# EAGLE design vfd_drive (EAGLE 9.5.2)
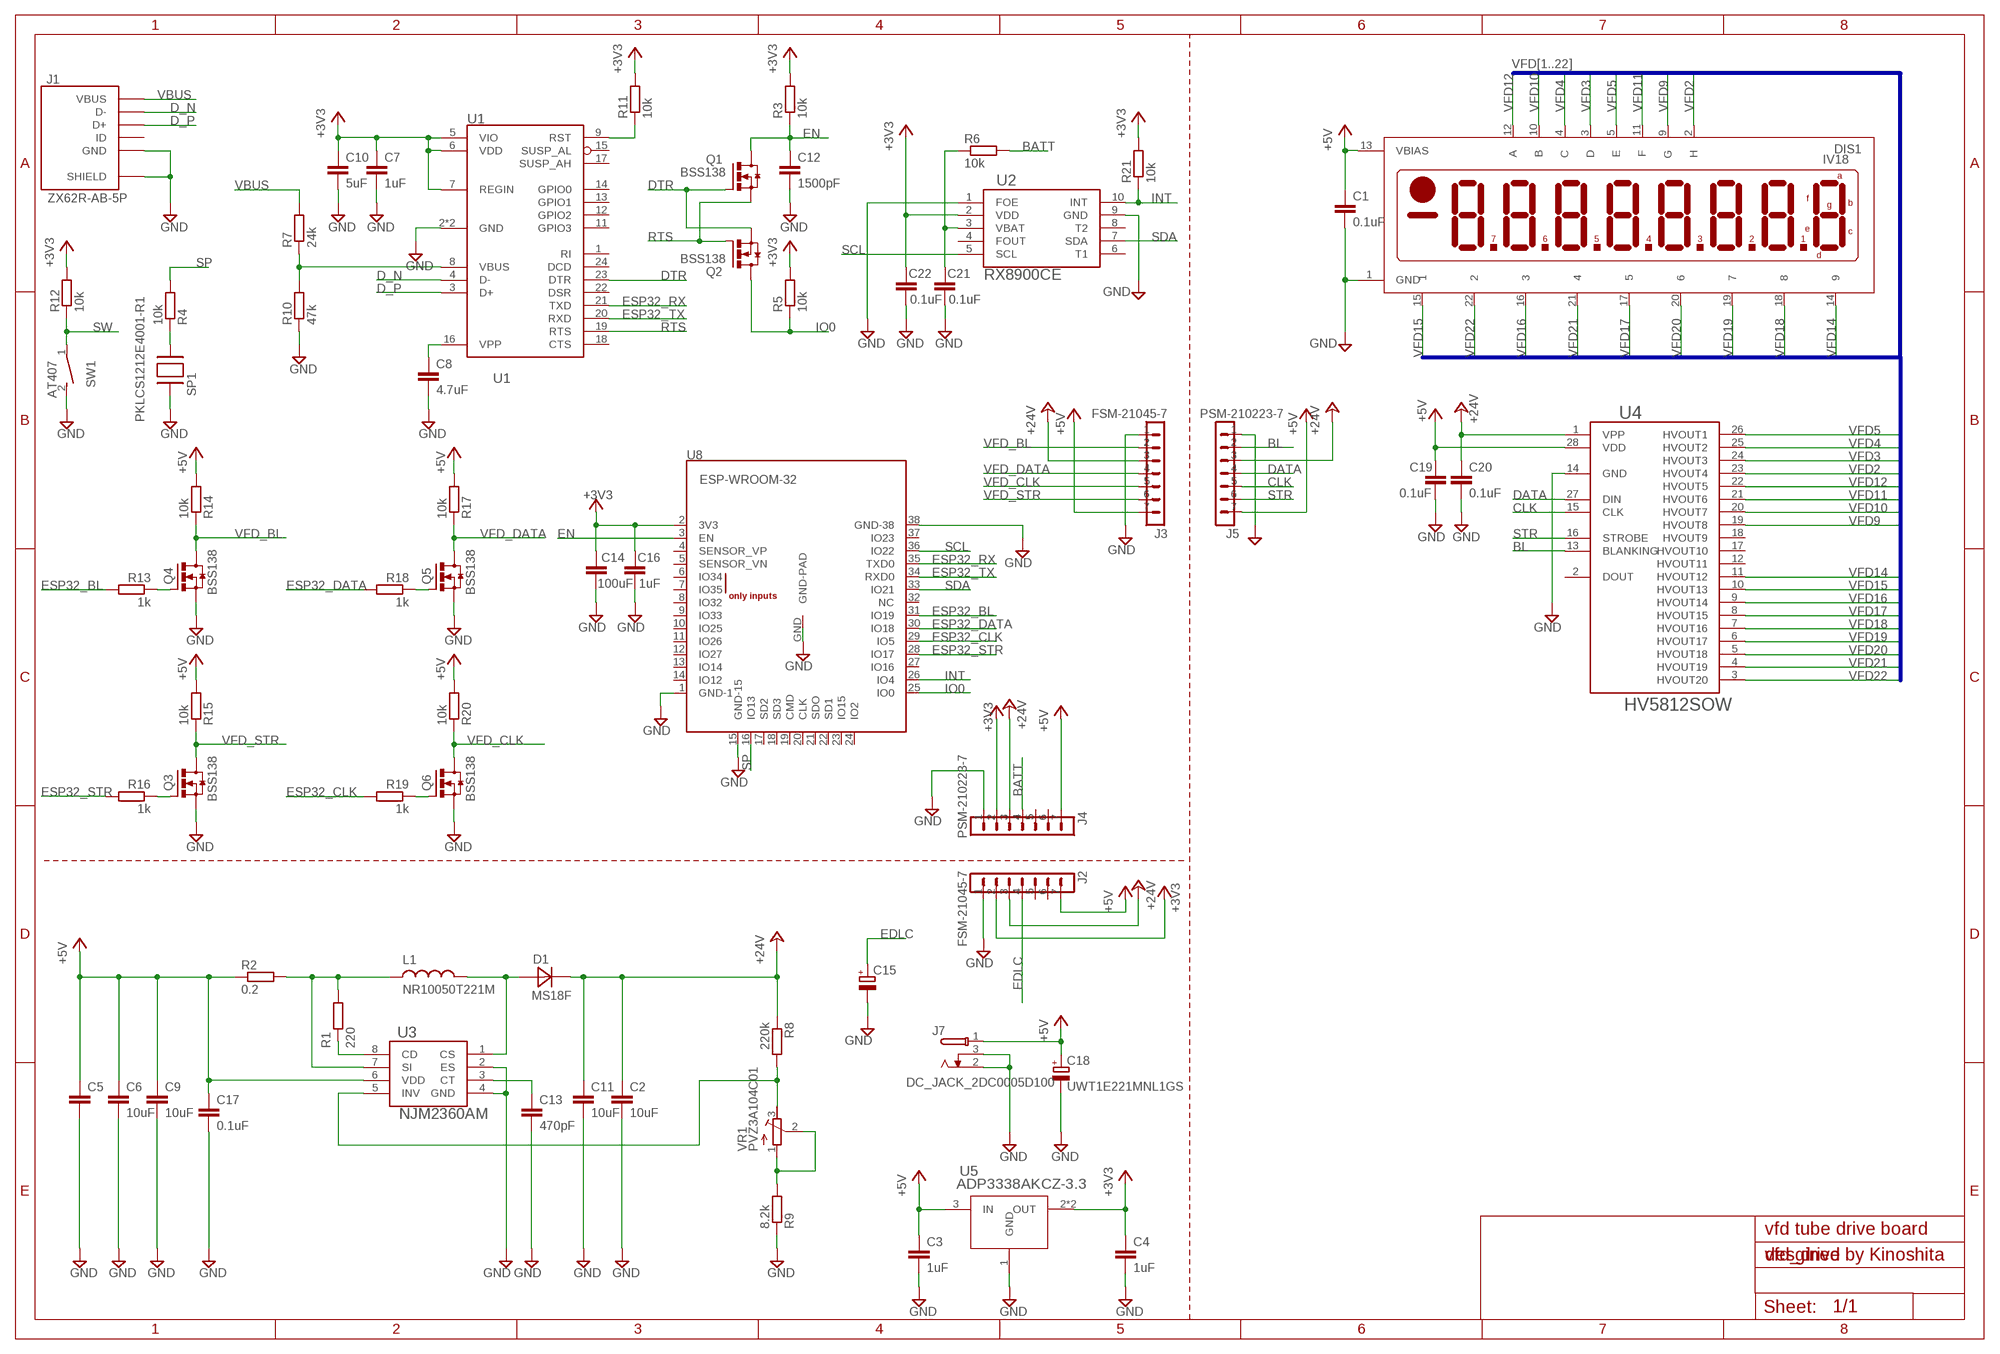
[diagram p0: schematic, sheet 1]

## Parts
C1  0.1uF  C-EUC0603  [C0603]
C2  10uF  C-EUC3216  [C3216]
C3  1uF  C-EUC0603  [C0603]
C4  1uF  C-EUC0603  [C0603]
C5  C-EUC3225  [C3225]
C6  10uF  C-EUC0603  [C0603]
C7  1uF  C-EUC0603  [C0603]
C8  4.7uF  C-EUC0603  [C0603]
C9  10uF  C-EUC0603  [C0603]
C10  5uF  C-EUC0603  [C0603]
C11  10uF  C-EUC3216  [C3216]
C12  1500pF  C-EUC0603  [C0603]
C13  470pF  C-EUC0603  [C0603]
C14  100uF  C-EUC1206  [C1206]
C15  CPOL-EUSE-5R5-D155VY  [SE-5R5-D155VY]
C16  1uF  C-EUC0603  [C0603]
C17  0.1uF  C-EUC0603  [C0603]
C18  UWT1E221MNL1GS  [NICHICON-ALMINUM-CAPACITOR-8MM]
C19  0.1uF  C-EUC0603  [C0603]
C20  0.1uF  C-EUC0603  [C0603]
C21  0.1uF  C-EUC0603  [C0603]
C22  0.1uF  C-EUC0603  [C0603]
D1  MS18F  [SMAF]
DIS1  IV18  [IV18]
J1  ZX62R-AB-5P  [ZX62R-B-5PA]
J2  FSM-21045-7  [FSM-21045-7]
J3  FSM-21045-7  [FSM-21045-7]
J4  PSM-210223-7  [PSM-210223-7]
J5  PSM-210223-7  [PSM-210223-7]
J7  DC_JACK_2DC0005D100  [DC_JACK_2DC0005D100]
L1  NR10050T221M  [NR10050T100M]
Q1  BSS138  [SOT23-N-MOSFET]
Q2  BSS138  [SOT23-N-MOSFET]
Q3  BSS138  [SOT23-N-MOSFET]
Q4  BSS138  [SOT23-N-MOSFET]
Q5  BSS138  [SOT23-N-MOSFET]
Q6  BSS138  [SOT23-N-MOSFET]
R1  220  R-EU_R0603  [R0603]
R2  0.2  R-EU_R1206  [R1206]
R3  10k  R-EU_R0603  [R0603]
R4  10k  R-EU_R0603  [R0603]
R5  10k  R-EU_R0603  [R0603]
R6  10k  R-EU_R0603  [R0603]
R7  24k  R-EU_R0603  [R0603]
R8  220k  R-EU_R0603  [R0603]
R9  8.2k  R-EU_R0603  [R0603]
R10  47k  R-EU_R0603  [R0603]
R11  10k  R-EU_R0603  [R0603]
R12  10k  R-EU_R0603  [R0603]
R13  1k  R-EU_R0603  [R0603]
R14  10k  R-EU_R0603  [R0603]
R15  10k  R-EU_R0603  [R0603]
R16  1k  R-EU_R0603  [R0603]
R17  10k  R-EU_R0603  [R0603]
R18  1k  R-EU_R0603  [R0603]
R19  1k  R-EU_R0603  [R0603]
R20  10k  R-EU_R0603  [R0603]
R21  10k  R-EU_R0603  [R0603]
SP1  PKLCS1212E4001-R1  [PKLCS1212E4001-R1]
SW1  AT407  [AT407]
U1  CP2104  [QFN24-SILABS]
U2  RX8900CE  [RX8900CE]
U3  NJM2360AM  [DMP8]
U4  HV5812SOW  [SOW28-MICROCHIP]
U5  ADP3338AKCZ-3.3  [SOT233]
U8  ESP-WROOM-32  [ESP-WROOM-32]
VR1  PVZ3A104C01  [PVZ3A]

## Nets
+3V3 [POWER]: C4.1 C7.1 C10.1 C14.1 C16.1 C22.1 J2.2 J4.2 R3.2 R5.2 R11.2 R12.2 R21.2 U1.5(VIO) U1.6(VDD) U1.7(REGIN) U2.2(VDD) U5.2(OUT) U5.4(OUT) U8.2(3V3)
+5V: C1.1 C3.1 C5.1 C6.1 C9.1 C17.1 C18.POS(+) C19.1 DIS1.13(VBIAS) J2.7 J3.7 J4.7 J5.7 J7.1 R2.1 R14.2 R15.2 R17.2 R20.2 U3.6(VDD) U4.28(VDD) U5.3(IN)
+24V: C2.1 C11.1 C20.1 D1.K(C) J2.3 J3.3 J4.3 J5.3 R8.1 U4.1(VPP)
BATT: J4.4 R6.2
BL: J5.2 U4.13(BLANKING)
CLK: J5.5 U4.15(CLK)
D_N: J1.D- U1.4(D-)
D_P: J1.D+ U1.3(D+)
DATA: J5.4 U4.27(DIN)
DTR: Q1.G Q2.S U1.23(DTR)
EDLC: C15.POS(+) J2.4
EN: C12.1 Q1.D R3.1 U8.3(EN)
ESP32_BL: R13.2 U8.31(IO19)
ESP32_CLK: R19.2 U8.29(IO5)
ESP32_DATA: R18.2 U8.30(IO18)
ESP32_RX: U1.21(TXD) U8.35(TXD0)
ESP32_STR: R16.2 U8.28(IO17)
ESP32_TX: U1.20(RXD) U8.34(RXD0)
GND: C1.2 C2.2 C3.2 C4.2 C5.2 C6.2 C7.2 C8.2 C9.2 C10.2 C11.2 C12.2 C13.2 C14.2 C15.NEG(-) C16.2 C17.2 C18.NEG(-) C19.2 C20.2 C21.2 C22.2 DIS1.1(GND) J1.GND J1.SHIELD@1(SHIELD) J1.SHIELD@2(SHIELD) J1.SHIELD@3(SHIELD) J1.SHIELD@4(SHIELD) J2.1 J3.1 J4.1 J5.1 J7.2 J7.3 Q3.S Q4.S Q5.S Q6.S R9.1 R10.1 SP1.2 SW1.2 U1.2(GND) U1.25(GND) U2.1(FOE) U2.9(GND) U3.2(ES) U3.4(GND) U4.14(GND) U5.1(GND) U8.1(GND-1) U8.15(GND-15) U8.38(GND-38) U8.GND(GND-PAD)
INT: R21.1 U2.10(INT) U8.26(IO4)
IO0: Q2.D R5.1 U8.25(IO0)
N$1: R9.2 VR1.1(E) VR1.2(S)
N$2: Q4.G R13.1
N$3: Q6.G R19.1
N$4: Q3.G R16.1
N$5: C21.1 R6.1 U2.3(VBAT)
N$6: D1.A L1.P$2 U3.1(CS)
N$7: R11.1 U1.9(RST)
N$8: R7.1 R10.2 U1.8(VBUS)
N$9: C8.1 U1.16(VPP)
N$10: R4.1 SP1.1
N$11: C13.1 U3.3(CT)
N$12: R8.2 U3.5(INV) VR1.3(A)
N$13: R1.1 U3.8(CD)
N$14: L1.P$1 R1.2 R2.2 U3.7(SI)
N$15: Q5.G R18.1
RTS: Q1.S Q2.G U1.19(RTS)
SCL: U2.5(SCL) U8.36(IO22)
SDA: U2.7(SDA) U8.33(IO21)
SP: R4.2 U8.16(IO13)
STR: J5.6 U4.16(STROBE)
SW: R12.1 SW1.1
VBUS: J1.VCC(VBUS) R7.2
VFD2: DIS1.2(H) U4.23(HVOUT4)
VFD3: DIS1.3(D) U4.24(HVOUT3)
VFD4: DIS1.4(C) U4.25(HVOUT2)
VFD5: DIS1.5(E) U4.26(HVOUT1)
VFD9: DIS1.9(G) U4.19(HVOUT8)
VFD10: DIS1.10(B) U4.20(HVOUT7)
VFD11: DIS1.11(F) U4.21(HVOUT6)
VFD12: DIS1.12(A) U4.22(HVOUT5)
VFD14: DIS1.14 U4.11(HVOUT12)
VFD15: DIS1.15 U4.10(HVOUT13)
VFD16: DIS1.16 U4.9(HVOUT14)
VFD17: DIS1.17 U4.8(HVOUT15)
VFD18: DIS1.18 U4.7(HVOUT16)
VFD19: DIS1.19 U4.6(HVOUT17)
VFD20: DIS1.20 U4.5(HVOUT18)
VFD21: DIS1.21 U4.4(HVOUT19)
VFD22: DIS1.22 U4.3(HVOUT20)
VFD_BL: J3.2 Q4.D R14.1
VFD_CLK: J3.5 Q6.D R20.1
VFD_DATA: J3.4 Q5.D R17.1
VFD_STR: J3.6 Q3.D R15.1
Unconnected: J1.ID J2.5 J2.6 J4.5 J4.6 U1.1(RI) U1.11(GPIO3) U1.12(GPIO2) U1.13(GPIO1) U1.14(GPIO0) U1.15(SUSP_AL) U1.17(SUSP_AH) U1.18(CTS) U1.22(DSR) U1.24(DCD) U2.4(FOUT) U2.6(T1) U2.8(T2) U4.2(DOUT) U4.12(HVOUT11) U4.17(HVOUT10) U4.18(HVOUT9) U8.4(SENSOR_VP) U8.5(SENSOR_VN) U8.6(IO34) U8.7(IO35) U8.8(IO32) U8.9(IO33) U8.10(IO25) U8.11(IO26) U8.12(IO27) U8.13(IO14) U8.14(IO12) U8.17(SD2) U8.18(SD3) U8.19(CMD) U8.20(CLK) U8.21(SDO) U8.22(SD1) U8.23(IO15) U8.24(IO2) U8.27(IO16) U8.32(NC) U8.37(IO23)

## Buses
VFD[1..22]

## Notes on the sheet
- vfd tube drive board
- desgined by Kinoshita

## Library data of the parts
C1-C14 C16 C17 C19-C22 = taki-library:C-EU: CAPACITOR, European symbol
C15 = taki-library:CPOL-EU: POLARIZED CAPACITOR, European symbol
C18 = taki-library:UWT1E221MNL1GS
D1 = taki-library:MS18F
DIS1 = taki-library:IV18: LCD DISPLAY 8-character 7 segment
J1 = taki-library:ZX62
J2 J3 = taki-library:FSM-21045-7
J4 J5 = taki-library:PSM-210223-7
J7 = taki-library:DC_JACK_2DC0005D100: AKIZUKIDENSHI 2DC-0005D100 SINGATRON ENTERPRISE CO., LTD http://akizukidenshi.com/download/2DC-0005D100.pdf
L1 = taki-library:NR10050T221M
Q1-Q6 = taki-library:BSS138
R1-R21 = taki-library:R-EU_: RESISTOR, European symbol
SP1 = taki-library:PKLCS1212E4001-R1
SW1 = taki-library:AT407
U1 = taki-library:CP2104
U2 = taki-library:RX8900CE
U3 = taki-library:NJM2360AM; STORE: RS; URL: https://jp.rs-online.com/web/p/dc-dc-controllers/7139849/
U4 = taki-library:HV5812
U5 = taki-library:ADP3338AKCZ-3.3
U8 = taki-library:ESP-WROOM-32
VR1 = taki-library:PVZ3A104C01

## Net classes
0 default: width 0.152 mm
1 POWER: width 0.254 mm
2 diffrencial pair: width 0.15 mm, clearance 0.3 mm to class 0, clearance 0.3 mm to class 1, clearance 0.15 mm
3 3pin digital: width 0.15 mm
4 high-voltage: width 0.3 mm, clearance 0.7 mm to class 0, clearance 0.7 mm to class 1, clearance 0.7 mm to class 2, clearance 0.7 mm to class 3, clearance 0.7 mm

## Board
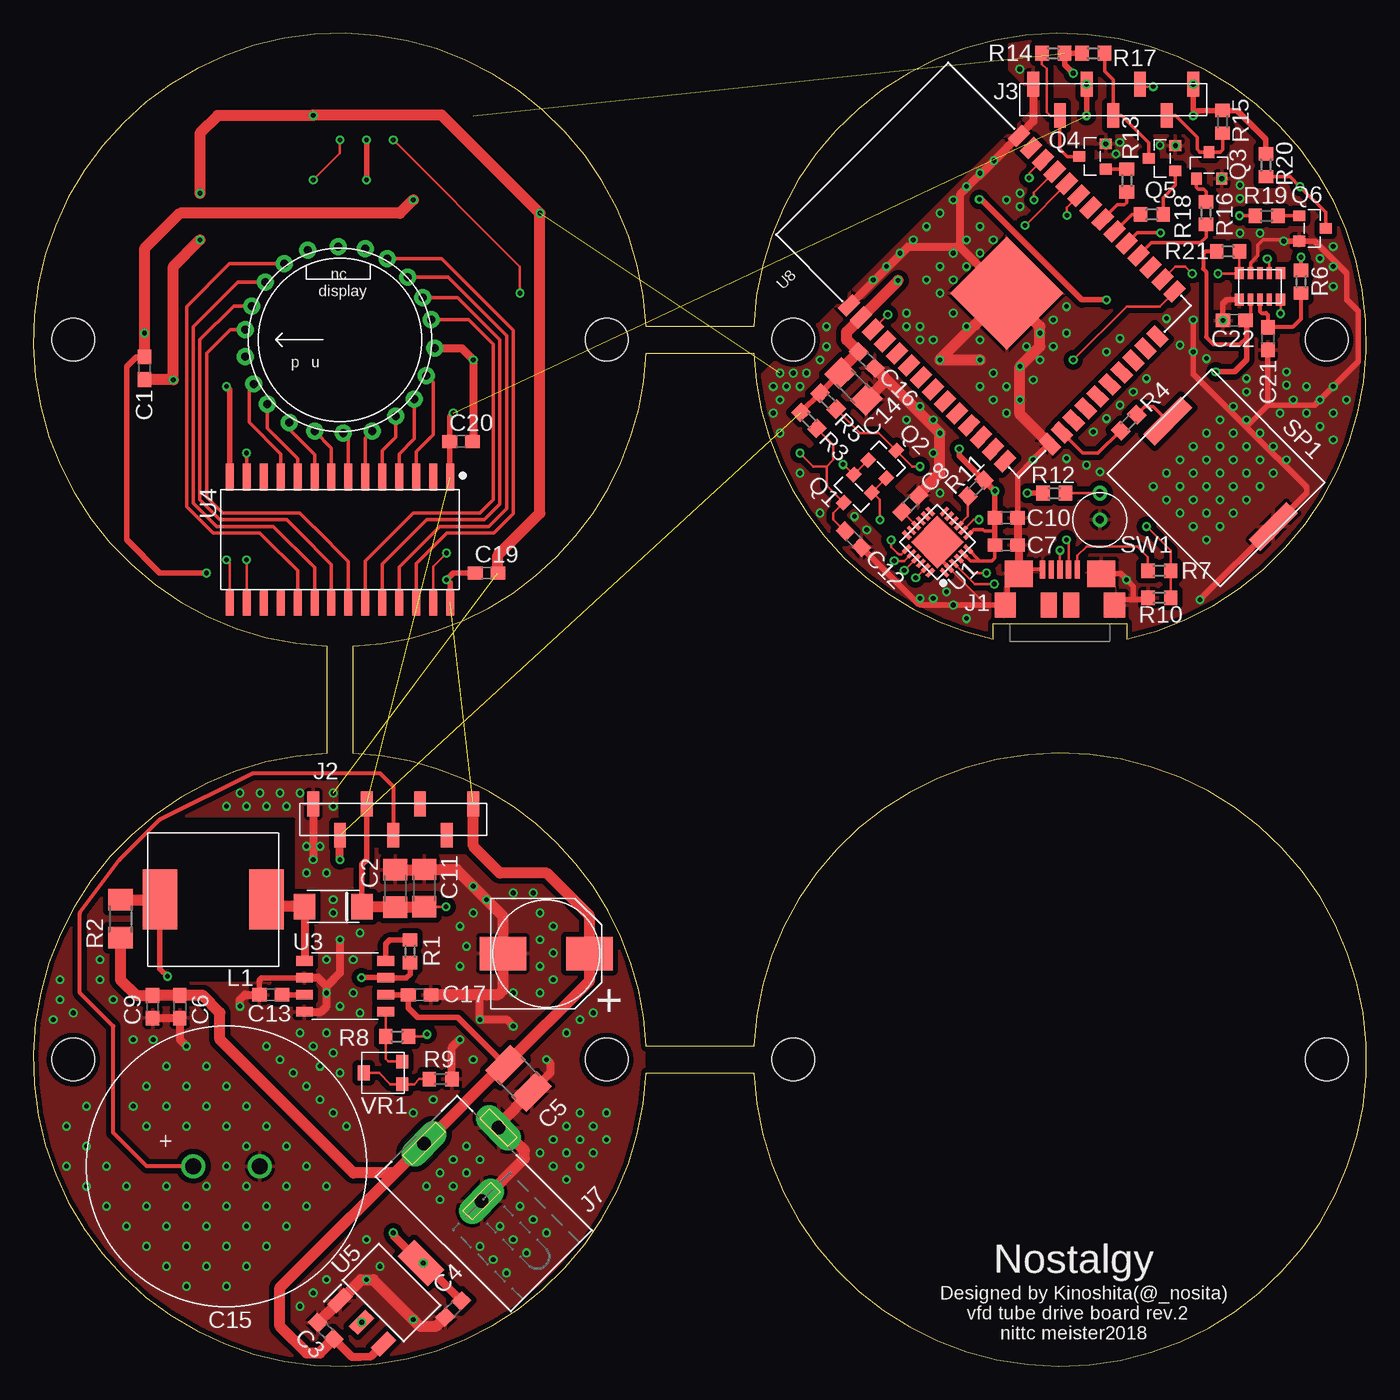
[diagram p1: board, top side]
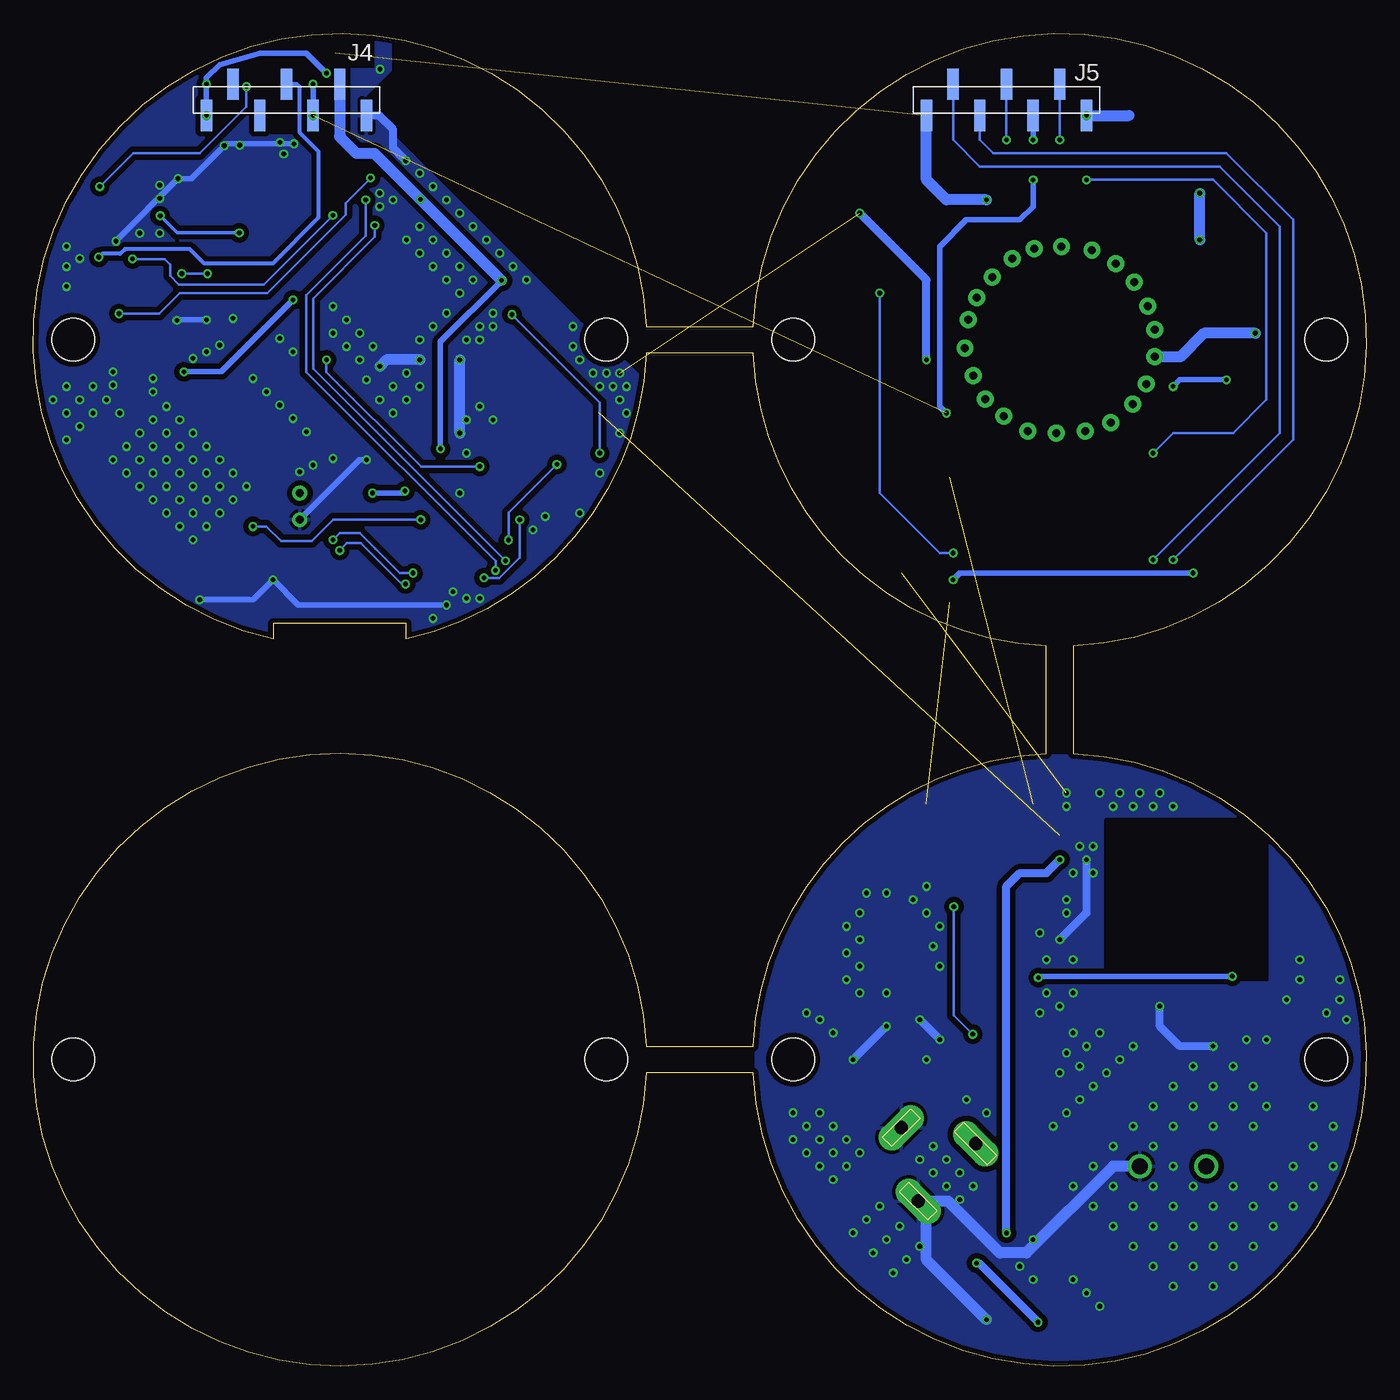
[diagram p2: board, bottom side, seen from below]

Size 99.98 x 100 mm. Coordinates in mm from the lower left corner, seen from the top.
Outline: 82,54.55 arc255 54.02,78 45.97,78 arc265 22,54.02 22,45.98 arc265 45.97,22 54.02,22 arc355 54.02,24 45.97,24 arc85 24,45.98 24,54.02 arc85 45.97,76 54.02,76 arc75 72,54.55 72,55.7 82,55.7 82,54.55
Copper layers (1*16): Top 0.035mm / dielectric 1.5mm / Bottom 0.035mm
Design rules "Elecrow_2-layer_eagle_rule": minimum track width 6mil, minimum drill 12mil, track to track 6mil, track to pad 6mil, pad to pad 6mil, via to via 6mil, smd to smd 0mil, copper to edge 10mil, drill to drill 10mil, minimum pad ring 10mil, minimum via ring 6mil, stop-mask expansion 2mil, vias tented up to drill 100mil, thermal gap 10mil
Holes 3.2 mm at 3,77 43,77 57,77 97,77 57,23 3,23 43,23 97,23

### Footprints (pad centres in the part's own frame; a part is rotated, then mirrored left to right if it is on the bottom)
C0603 = smd 1.1 x 1: 1 -0.85,0; 2 0.85,0
C3216 = smd 1.6 x 1.8: 1 -1.4,0; 2 1.4,0
C3225 = smd 1.6 x 2.7: 1 -1.4,0; 2 1.4,0
C1206 = smd 1.6 x 1.8: 1 -1.4,0; 2 1.4,0
SE-5R5-D155VY = drill 1.2: NEG 2.5,0; POS -2.5,0
NICHICON-ALMINUM-CAPACITOR-8MM = smd 2.5 x 3.5: NEG 0,-3.25; POS 0,3.25
SMAF = smd 1.6 x 1.9: A -2.15,0; K 2.15,0
IV18 = drill 0.6 pad 1.27: 1 -0.635,-7.112; 2 1.524,-6.858; 3 3.175,-6.223; 4 4.699,-5.08; 5 6.096,-3.556; 6 6.858,-1.905; 7 6.985,0.127; 8 6.731,2.413; 9 5.715,4.191; 10 4.318,5.588; 11 2.54,6.604; 12 0.762,7.112; 13 -1.27,7.112; 14 -3.302,6.477; 15 -4.826,5.461; 16 -6.223,3.81; 17 -6.858,1.905; 18 -6.985,-0.254; 19 -6.858,-2.413; 20 -5.715,-4.191; 21 -4.445,-5.588; 22 -2.667,-6.477
ZX62R-B-5PA = smd 0.4 x 1.35: D+ 0,2.675; D- 0.65,2.675; GND -1.3,2.675; ID -0.65,2.675; VCC 1.3,2.675 | smd 1.2 x 1.9: NC@1 -0.85,0; NC@2 0.85,0 | smd 2.1 x 2: SHIELD@1 -3.1,2.35; SHIELD@2 3.1,2.35 | smd 1.6 x 1.9: SHIELD@3 -4.1,0; SHIELD@4 4.1,0
FSM-21045-7 = smd 0.89 x 1.85: 1 0,1.175; 2 2,-1.175; 3 4,1.175; 4 6,-1.175; 5 8,1.175; 6 10,-1.175; 7 12,1.175
PSM-210223-7 = smd 0.85 x 2.35: 1 0,1.175; 2 2,-1.175; 3 4,1.175; 4 6,-1.175; 5 8,1.175; 6 10,-1.175; 7 12,1.175
DC_JACK_2DC0005D100 = drill 1 pad 2 long: 1 -3.1,0; 2 3,0; 3 0,4.8
NR10050T100M = smd 2.6 x 4.5: P$1 -4,0; P$2 4,0
SOT23-N-MOSFET = smd 0.8 x 0.9: D 0,1; G -0.95,-1; S 0.95,-1
R0603 = smd 1 x 1.1: 1 -0.85,0; 2 0.85,0
R1206 = smd 1.6 x 1.803: 1 -1.422,0; 2 1.422,0
PKLCS1212E4001-R1 = smd 1.2 x 4: 1 11.2,0; 2 0,0
AT407 = drill 0.6: 1 0,2; 2 0,0
QFN24-SILABS = smd 0.75 x 0.3: 1 -2,1.25; 2 -2,0.75; 3 -2,0.25; 4 -2,-0.25; 5 -2,-0.75; 6 -2,-1.25; 13 2,-1.25; 14 2,-0.75; 15 2,-0.25; 16 2,0.25; 17 2,0.75; 18 2,1.25 | smd 0.3 x 0.75: 7 -1.25,-2; 8 -0.75,-2; 9 -0.25,-2; 10 0.25,-2; 11 0.75,-2; 12 1.25,-2; 19 1.25,2; 20 0.75,2; 21 0.25,2; 22 -0.25,2; 23 -0.75,2; 24 -1.25,2 | smd 2.8 x 2.8: 25 0,0
RX8900CE = smd 0.7 x 0.9: 1 -1.55,-1; 5 1.55,-1; 8 1.55,1; 10 -1.55,1 | smd 0.4 x 0.9: 2 -0.7,-1; 3 0,-1; 4 0.7,-1; 6 0,1; 7 0.7,1; 9 -0.7,1
DMP8 = smd 1.27 x 0.72: 1 -3.05,1.905; 2 -3.05,0.635; 3 -3.05,-0.635; 4 -3.05,-1.905; 5 3.05,-1.905; 6 3.05,-0.635; 7 3.05,0.635; 8 3.05,1.905
SOW28-MICROCHIP = smd 0.6 x 2: 1 -8.255,-4.7; 2 -6.985,-4.7; 3 -5.715,-4.7; 4 -4.445,-4.7; 5 -3.175,-4.7; 6 -1.905,-4.7; 7 -0.635,-4.7; 8 0.635,-4.7; 9 1.905,-4.7; 10 3.175,-4.7; 11 4.445,-4.7; 12 5.715,-4.7; 13 6.985,-4.7; 14 8.255,-4.7; 15 8.255,4.7; 16 6.985,4.7; 17 5.715,4.7; 18 4.445,4.7; 19 3.175,4.7; 20 1.905,4.7; 21 0.635,4.7; 22 -0.635,4.7; 23 -1.905,4.7; 24 -3.175,4.7; 25 -4.445,4.7; 26 -5.715,4.7; 27 -6.985,4.7; 28 -8.255,4.7
SOT233 = smd 1.75 x 0.95: 1 -3.15,2.3; 2 -3.15,0; 3 -3.15,-2.3 | smd 1.75 x 3.2: 4 3.15,0
ESP-WROOM-32 = smd 0.9 x 1.5: 1 7.7,9; 2 6.43,9; 3 5.16,9; 4 3.89,9; 5 2.62,9; 6 1.35,9; 7 0.08,9; 8 -1.19,9; 9 -2.46,9; 10 -3.73,9; 11 -5,9; 12 -6.27,9; 13 -7.54,9; 14 -8.81,9; 25 -8.81,-9; 26 -7.54,-9; 27 -6.27,-9; 28 -5,-9; 29 -3.73,-9; 30 -2.46,-9; 31 -1.19,-9; 32 0.08,-9; 33 1.35,-9; 34 2.62,-9; 35 3.89,-9; 36 5.16,-9; 37 6.43,-9; 38 7.7,-9 | smd 1.5 x 0.9: 15 -10.3,5.715; 16 -10.3,4.445; 17 -10.3,3.175; 18 -10.3,1.905; 19 -10.3,0.635; 20 -10.3,-0.635; 21 -10.3,-1.905; 22 -10.3,-3.175; 23 -10.3,-4.445; 24 -10.3,-5.715 | smd 6 x 6: GND 0,0
PVZ3A = smd 1 x 0.9: 1 -0.85,-1.45; 3 0.85,-1.45 | smd 1.1 x 0.9: 2 0,1.45

### Placement (x,y rotation side)
C1  8.34,74.87 270 top
C2  27.13,35.84 90 top
C3  21.94,2.65 135 top
C4  31.5,4.29 225 top
C5  36.39,21.6 315 top
C6  10.99,26.97 270 top
C7  72.97,61.61 0 top
C8  65.77,64.71 45 top
C9  8.95,26.97 270 top
C10  72.97,63.64 0 top
C11  29.34,35.87 90 top
C12  61.51,62.06 315 top
C13  17.81,27.87 180 top
C14  61.5,73.5 315 top
C15  14.5,15 0 top
C16  62.5,75.5 315 top
C17  28.97,27.86 0 top
C18  38.47,30.96 270 top
C19  34,59.5 0 top
C20  32.09,69.37 0 top
C21  92.6,77.09 270 top
C22  90.07,78.46 180 top
D1  22.5,34.48 0 top
DIS1  23,77 90 top
J1  77,57.1 0 top
J2  21,41 0 top
J3  75,95 0 top
J4  75,95 180 bottom
J5  21,95 180 bottom
J7  31.5,14.5 315 top
L1  13.5,35 0 top
Q1  61.5,65.5 135 top
Q2  64,68 315 top
Q3  88.19,90.09 0 top
Q4  79.44,90.76 90 top
Q5  84.66,90.62 90 top
Q6  95.93,85.35 270 top
R1  28.26,31.13 270 top
R2  6.54,33.57 90 top
R3  58.17,70.96 135 top
R4  82.15,70.8 225 top
R5  59.61,72.4 135 top
R6  95.08,81.36 90 top
R7  84.46,59.67 180 top
R8  27.28,24.74 180 top
R9  30.55,21.54 180 top
R10  84.46,57.64 0 top
R11  70.7,65.88 45 top
R12  76.57,65.5 180 top
R13  82.01,88.95 270 top
R14  76.5,98.5 0 top
R15  89.2,93.36 90 top
R16  87.96,86.51 270 top
R17  79.5,98.5 180 top
R18  83.9,86.4 180 top
R19  92.5,86.31 180 top
R20  92.45,90.09 90 top
R21  89.61,83.63 180 top
SP1  93,63 135 top
SW1  80,63.5 0 top
U1  67.81,61.83 135 top
U2  92,81 0 top
U3  23.39,28.5 0 top
U4  23,62 180 top
U5  26.86,5.52 45 top
U8  73,80.5 135 top
VR1  26.22,22.01 90 top

### Tracks (layer width: path | path; a pad name or v marks a point on that pad's centre or on a via)
+3V3  (via drill 0.35)  (1 unrouted)
  Top 0.254: U1.5 70.3,60.4 71,60.4 | 71.92,61.61 C7.1 72.12,60.62 71.9,60.4 71,60.4 | U1.6 71,60.41 71,60.4 | U1.7 70.52,62.77 71.21,62.77 71.35,62.64 72.12,62.64 | C22.1 91.3,78.84 U2.2
  Top 0.305: R21.2 87.9,83.63 87.74,83.47 87.74,82.33 87.96,82.11 87.96,77.22 88.51,76.67 90.49,76.67 91,77.18 91,78.39
  Top 0.406: 71.24,66.42 R11.2 | C14.1 59.02,73 R5.2 R3.2 | v69.45,68.83 69.45,68.33 R11.2 | R11.2 v72.12,65.66 C10.1 72.12,62.64 C7.1 | v74.55,65.5 R12.2 | v80.5,80 78.65,80 71.1,87.54 v70.95,87.54 | v88.69,74.6 90.1,74.6 91,75.5 91,78.39 C22.1
  Top 0.61: C4.1 v29.24,7.75 U5.4 27,9.83 v27,10 | v23,38 J2.2
  Top 0.813: C14.1 60.51,74.71 C16.1 61,77 61,77.59 U8.2 v64.85,81.45 v64.86,81.45
  Bottom 0.406: v69.45,68.83 69.45,76.86 v64.86,81.45 | v72.12,65.66 72.28,65.5 v74.55,65.5 | v88.69,74.6 85.9,74.6 v80.5,80
  Bottom 0.61: 77,92.26 77.01,92.25 | v27,10 27,36 26,37 24,37 v23,38 | U5.2 U5.4 v29.24,7.75
  Bottom 0.813: 77.01,92.25 75.76,91 74.41,91 v70.95,87.54 v64.86,81.45 | J4.2 77,92.26
  other vias: 24.63,3.29
+5V  (via drill 0.35)  (2 unrouted)
  Top 0.406: J3.7 J4.7 87.38,94.21 R15.2 90.29,94.21 92.45,92.05 R20.2 | R17.2 R14.2 77.35,97.65 v78,97 | C1.1 7.72,75.72 7,75 7,62 9.5,59.5 v13,59.5 | U4.28 31.25,58.74 v31,59 31.5,59.5 C19.1 | U3.6 C17.1 28.12,26.88 28.84,26.16 31.84,26.16 C5.1
  Top 0.61: C3.1 23.9,0.69 24.48,0.69 25.34,0.75 U5.3
  Top 0.813: v28.5,87.5 27.5,86.5 11,86.5 8.34,83.84 v8.34,77.5 C1.1 | J7.1 27.11,14.5 24,14.5 14,24.5 14,26.52 12.7,27.82 C6.1 C9.1 7.71,27.82 6.54,28.99 R2.1 | J7.1 35.2,22.59 C5.1 41.72,28.91 C18.POS 41.72,33.78 38.5,37 35,37 33,39 J2.7 | J7.1 18.5,5.88 18.5,3 20.5,1 21.49,1 C3.1
  Bottom 0.406: J4.7 J3.7 87,96.67 86,97.66 82.97,98.5 79.5,98.5 v78,97 | v31,59 30.5,59.5 v13,59.5
  Bottom 0.61: 15.87,75.72 DIS1.13
  Bottom 0.813: v28.5,87.5 31.5,87.5 33,89 J5.7 | v8.34,77.5 12.19,77.5 13.97,75.72 15.87,75.72
  other vias: 87,96.17 87,93.82
+24V  (via drill 0.35)  (2 unrouted)
  Top 0.203: R8.1 29.37,24.74 v29.53,24.9 | v30.95,34.47 C11.1
  Top 0.406: J3.3 J4.3 | v25,89 v25,92 | U4.1 31.24,66.71 C20.1 31.24,71.24 v31.5,71.5 | D1.K 24.65,37.65 25,38 J2.3
  Top 0.813: D1.K 27.09,34.48 C2.1 27.16,34.47 C11.1
  Bottom 0.203: v29.53,24.9 30.95,26.32 v30.95,34.47
  Bottom 0.406: J4.3 J3.3 | v31.5,71.5 32,72 32,84 30,86 26,86 25,87 v25,89 | J5.3 v25,92
  other vias: 79,96.17 79,93.82
BATT  (via drill 0.35)
  Top 0.305: R6.2 v95.08,83.2
  Bottom 0.305: v95.08,83.2 94.83,83.45 93.47,83.45 93.1,83.82 88.27,83.82 87.18,82.73 82.04,82.73 78.58,86.19 78.58,91.11 80,92.53 80,95.96 80.21,96.17 J4.4
BL  (via drill 0.35)
  Top 0.203: v21,89 23,91 v23,92
  Top 0.254: U4.13 16.01,68.48 v16,68.5
  Bottom 0.203: v16,68.5 14.5,70 10,70 7.5,72.5 7.5,85 11.5,89 v21,89 | J5.2 v23,92
CLK  (via drill 0.35)
  Top 0.203: U4.15 14.74,60.25 v14.5,60.5
  Bottom 0.203: v14.5,60.5 5.5,69.5 5.5,86 10.5,91 28,91 29,92 J5.5
D_N  (via drill 0.35)
  Top 0.203: v77.5,62 77.65,61.85 J1.D- | U1.4 70.49,59.5 v71.5,59.5
  Bottom 0.203: v77.5,62 77,62.5 75.5,62.5 74.35,61.36 72.49,59.5 v71.5,59.5
D_P  (via drill 0.35)
  Top 0.203: v77,61.2 J1.D+ | U1.3 70.6,58.68 v72.07,58.68
  Bottom 0.203: v77,61.2 76.46,61.74 75.43,61.74 72.37,58.68 v72.07,58.68
DATA  (via drill 0.35)
  Top 0.203: U4.27 29.98,59.98 v31,61 | v27,92 36.5,82.5 v36.5,80.5
  Bottom 0.203: v31,61 32,61 36.5,65.5 v36.5,80.5 | J5.4 v27,92
DTR  (via drill 0.35)
  Top 0.203: Q1.G 62.92,65.58 | 62.92,65.58 Q2.S | v66.18,59.14 U1.23 | v63.5,63.49 63.5,65 62.92,65.58
  Bottom 0.203: v63.5,63.49 63.5,60.67 65.04,59.12 65.56,59.12 65.58,59.14 v66.18,59.14
EDLC
  Top 0.305: C15.POS 8.5,15 6,17.5 6,25.5 3.5,28 3.5,34 6.5,38 9.5,41 16.5,44.5 26,44.5 27,43.5 J2.4
EN  (via drill 0.35)
  Top 0.203: R3.1 60,69.13 60,68 59.5,67.5 | 59.5,67.5 59.5,66.09 Q1.D 60,64 60,63.5 60.83,62.66 C12.1 | U8.3 v64.09,78.89 | v57.5,68.5 58.5,67.5 59.5,67.5
  Bottom 0.203: v64.09,78.89 57.5,72.3 v57.5,68.5
ESP32_BL
  Top 0.254: R13.2 82.01,87.3 81.84,87.13 81.31,87.13 U8.31
ESP32_CLK  (via drill 0.35)
  Top 0.254: U8.29 82.8,85.03 v84.54,85.03 | v90.47,86.31 v90.48,86.32 R19.2
  Bottom 0.254: v84.54,85.03 89.2,85.03 v90.47,86.3 v90.47,86.31
ESP32_DATA
  Top 0.254: U8.30 82.37,86.4 R18.2
ESP32_RX  (via drill 0.35)
  Top 0.203: U1.21 v65.32,59.7 | v75.05,87.49 75.05,88.05 U8.35
  Bottom 0.203: v75.05,87.49 75.05,84.8 79.5,80.35 79.5,74.58 65.32,60.4 v65.32,59.7
ESP32_STR
  Top 0.254: U8.28 83.86,84.29 87.53,84.29 87.96,84.72 R16.2
ESP32_TX  (via drill 0.35)
  Top 0.203: U1.20 65.33,60.42 v64.57,60.42 | U8.34 v74.38,85.58
  Bottom 0.203: v64.57,60.42 79,74.85 79,80.11 74.38,84.73 v74.38,85.58
GND  (via drill 0.35)  (2 unrouted)
  Top 0.203: 68,61 68,60.58 U1.2 71.47,57.1 71.5,57.1
  Top 0.254: U2.9 91.3,82.8 91.82,83.32 91.82,84.1 92.23,84.51 93.68,84.51 v93.78,84.41
  Top 0.305: J1.GND 74.22,59.77 J1.SHIELD@1 | U1.2 67.81,60.77 U1.25
  Top 0.406: C10.2 73.82,66.82 v75,68 76.2,69.21 | 83.61,57.37 R10.1 | J1.SHIELD@3 71.5,57.1 v69,57.1 66.56,57.1 66.37,57.19 C12.2 | 82.5,57.5 82.5,58.5 v82,59 81.55,59.45 J1.SHIELD@2 | J1.SHIELD@1 73.75,59.3 73.16,59.3 73.04,59.18 73.04,57.5 | 83.47,57.5 81.5,57.5 | v87.5,57.5 SP1.2 95.5,65.5 95.5,65.94 90.97,70.47 | v93.78,84.41 v93.79,84.4 Q6.S 96.1,84.4 98.5,82 98.5,80 99.35,79.14 99.37,78.99 99.37,75.37 96.1,72.1 92.6,72.1 | v14.5,73.5 14.74,73.25 U4.14 | C13.2 16.96,28.96 17.13,29.13 U3.2 | v87,78.5 87,74.44 90.97,70.47 | C22.2 89.22,79.72 89.5,80 U2.1 | C21.2 92.6,72.1 | 92.6,72.1 90.97,70.47
  Top 0.61: C10.2 C7.2 73.9,61.53 J1.SHIELD@1 73.9,59.65 | U8.1 65.61,84 69.5,84 | 69.5,84 U8.GND | 69.5,84 69.5,87.89 v72.05,90.44 U8.38 75,93.39 J3.1 | 12.5,92.5 13.87,93.87 20.95,93.87 J5.1 | DIS1.1 32.13,76.36 v33,75.5 33,69.43 C20.2 | U3.4 21.59,26.59 22,27 22,28.5 | 22,28.5 21.36,29.13 U3.2 | C9.2 C6.2 10.99,24.51 v11.5,24 | v15.5,27 15.5,27.5 15.87,27.87 C13.2 | J2.1 v21,38 | v23,32 23,29.5 22,28.5 | R9.1 31.4,23.9 v32,24.5 | 33.5,27.86 v33.5,26 35.5,26 v36,25.5 | v38.5,23 38.79,22.71 38.79,22.02 C5.2
  Top 0.813: C14.2 63.79,73.81 63.79,74.21 C16.2 v68,70 68,67 66.37,65.37 C8.2 | U8.15 74,71.42 v74,75 75.5,76.5 75.5,78 U8.GND v68,75.5 v71,75.5 | R10.1 83.47,57.5 | 81.5,57.5 81.15,57.16 81.15,57.1 | C19.2 34.85,60.85 38,64 v38,86.5 30.63,93.87 20.95,93.87 | J5.1 13.82,93.82 12.5,92.5 v12.5,88 | C1.2 10.48,74.02 v10.5,74 10.5,82.5 v12.5,84.5 | C3.2 U5.1 24.58,6.5 25.5,6.5 v28.5,3.5 29,3 30.21,3 C4.2 | C5.2 34.89,18.12 | 34.89,18.12 J7.3 | J7.2 36.83,15.59 36.83,16.19 34.89,18.12 | C2.2 29.31,37.24 C11.2 31.73,37.27 35.22,33.78 C18.NEG 35.22,28.22 34.86,27.86 33.5,27.86 C17.2
  Bottom 0.406: v69,57.1 80.1,57.1 v82,59 83.5,57.5 v87.5,57.5 | SW1.2 75.5,68 v75,68 | Q4.S 85.52,91.71 Q5.S 88.14,89.09 Q3.S 93.78,84.45 v93.78,84.41 | v14.5,73.5 14,74 v10.5,74 | v87,78.5 89.18,78.5 C22.2
  Bottom 0.61: v72.05,90.44 73,91.39 73,92.8 74.02,93.82 J4.1 | v33,75.5 33,81.5 v38,86.5 | v11.5,24 14,24 15.5,25.5 v15.5,27 | v21,38 21,34 v23,32 | v32,24.5 v33.5,26 | v36,25.5 v38.5,23
  Bottom 0.813: v68,70 v68,75.5 | J5.1 17.82,93.82 | v12.5,84.5 v12.5,88 | v71,75.5 73.5,75.5 v74,75 | v28.5,3.5 33,8 33,11.76 J7.2 31.37,12.38 27.5,8.5 25.5,8.5 19,15 C15.NEG
  other vias: 80.44,91.71 85.66,91.57 89.14,89.09 21,93.82 89.22,78.46 90.5,85 92,85 97.5,84 97.5,82.5 97.5,81 96.5,70.5 96.5,72.5 97.5,71.5 95.5,71.5 94.5,72.5 95.5,73.5 97.5,73.5 98.5,72.5 97.5,69.5 93.5,71.5 92,70 91,71 90,70 91,69 89,69 90,68 88,68 89,67 87,67 88,66 93,69 94,68 93,67 92,68 91,67 92,66 90,66 91,65 89,65 90,64 86,66 87,65 85,65 86,64 88,64 89,63 87,63 88,62 84,66 85,67 86,68 87,69 88,70 89,71 90,72 77.5,79.5 77.5,77.5 76.5,78.5 75.5,77.5 76.5,76.5 75.5,75.5 74.5,76.5 72,74.5 73,73.5 71,73.5 72,72.5 73,71.5 74,72.5 75,74 65.5,78 66.5,77 66.5,78 67.5,77 65.5,79 67,81.5 68,82.5 69,83.5 70,84.5 71,85.5 72,84.5 71,83.5 70,82.5 69,81.5 68,80.5 65,83.5 64,82.5 63,81.5 66,84.5 67,85.5 68,86.5 69,87.5 70,88.5 71,89.5 74,88 73,87.5 74,87 69,79 70,78 71,77 56,74.5 55.5,73.5 56.5,73.5 56,72.5 55.5,71.5 57,74.5 57.5,73.5 58,74.5 59,75.5 59.5,76.5 59.5,78 66.5,72 65.5,71 67.5,71 67.5,68.5 68,65.5 56,70 57.5,67 59,64 62.51,62.75 61.59,63.75 67.5,57.6 70,56.1 66.5,57.6 68.5,58.1 79,67.6 80,67.1 77.5,68.1 79.5,70.1 80.5,71.1 81.5,72.1 82.5,73.1 83.5,74.1 86,76.6 80.5,76.1 81.5,77.1 85,78.6 87,76.1 88,75.6 91,74.1 91,73.1 94,74.6 94,73.6 96.5,83.1 90.5,88.6 90.5,87.6 84.5,91.6 81.2,90.94 81.48,91.81 73.98,97.31 14.5,42 16,42 17.5,42 17,43 15.5,43 18.5,43 19,42 20,43 20.5,39 21.5,39 20.5,37 22,37 22.5,35 22.5,34 24.5,32.5 24,30.5 22,30.5 22,28 24,28 23,27 24.5,26.5 22,25 17.5,24 18.5,23 19.5,22 20.5,21 21.5,20 22.5,19 23.5,18 33,36 33,34 34,35 38,34 39,33 38,32 39,31 38,30 39,29 38,28 36,28 32,33 32.5,31.5 32,30 42,26.5 41,26 40,25 41,19 42,18 43,17 42,16 41,17 40,18 39,17 40,16 41,15 38,16 39,15 40,14 32.5,16.5 33.5,15.5 31.5,15.5 32.5,14.5 30.5,14.5 31.5,13.5 29.5,13.5 30.5,12.5 36.5,12 37.5,11 35,10.5 36,9.5 37,8.5 38.5,10 33.5,9 34.5,8 35.5,7 20,4.5 21,5.5 22,6.5 25,6.5 26,7.5 25,9.5 10,22.5 11.5,21 8.5,21 10,19.5 8.5,18 11.5,18 13,19.5 13,22.5 14.5,21 16,19.5 14.5,18 17.5,18 14.5,15 14.5,12 19,16.5 16,16.5 16,13.5 20.5,15 19,13.5 17.5,12 16,10.5 13,13.5 22,13.5 20.5,12 19,10.5 17.5,9 13,10.5 11.5,12 14.5,9 16,7.5 13,7.5 14.5,6 11.5,9 10,10.5 10,13.5 8.5,12 7,10.5 8.5,9 10,7.5 11.5,6 5.5,12 7,13.5 5.5,15 4,16.5 2.5,18 2.5,15 4,13.5 4,19.5 2,29 2,27.5 1.5,26 3,26.5 5,30.5 5,29 6,27.5 7.5,24.5 9,24.5 7.5,19.5 20,25 21,24 22.5,23.5 23,22 21.5,22.5 30,20 28.5,19 33,23 36,35.5 37.5,35.5 43,19 22.5,43 22.5,42
  pour Top (isolate 0.4): 23,100 0,100 0,0 100,0 100,77 100,100
  pour Bottom (isolate 0.4): -0.5,100 -0.5,0 77,0 100,0 100,77 100,100
  cutout Top: 46,78 46,76 54,76 54,78
  cutout Bottom: 46,78 46,76 54,76 54,78
  cutout Top: 77.5,91.5 79.5,91.5 79.5,89 83,89 83,90.5 85.5,90.5 85.5,85.5 82,85.5 77,90.5 77,91.5
  cutout Top: 81,99.5 81,92.5 87,92.5 87,97.5 85,99.5
  cutout Top: 90,81.5 90,80.5 94,80.5 94,81.5
  cutout Top: 59,79 53.5,73.5 53.5,84 69,99.5 73,99.5 73,97 73,93
  cutout Bottom: 59,79 53.5,73.5 53.5,84 69,99.5 73,99.5 73,97 73,93
  cutout Top: 7.5,41 7.5,29 19.5,29 19.5,41
  cutout Bottom: 7.5,41 7.5,29 19.5,29 19.5,41
  cutout Top: 46,24 46,22.5 46,22 54,22 54,24
  cutout Bottom: 46,24 46,22 54,22 54,24
  cutout Top: 60.5,71 58,68.5 58,68 64,62 64.5,62 65.5,63 65.5,65 64.5,66 65.5,67 65.5,67.5 63,70 62.5,70 61.5,71
  cutout Bottom: 74.5,99.5 74.5,97.5 78,97.5 78,99.5
  cutout Bottom: 80.5,98 80.5,92.5 82,92.5 84,94.5 84,97.5 83.5,98
  cutout Top: 46,100 46,46 0,46 0,100
  cutout Bottom: 0,100 0,46 46,46 46,100
  cutout Top: 21,46 21,44 23,44 23,37.5 24,37.5 24,39 26,39 26,38.5 34,38.5 34.5,38.5 34.5,46
INT  (via drill 0.35)
  Top 0.203: R21.1 U2.10 90.42,81.97 v88.85,81.97 | U8.26 85.65,82.49 86.4,82.49 v86.92,81.97
  Bottom 0.203: v86.92,81.97 v88.85,81.97
IO0  (via drill 0.35)
  Top 0.203: R5.1 62.01,70 63.41,70 Q2.D 65.91,67.5 v66.5,67.5 | U8.25 85.59,80.59 84.5,79.5 82,79.5 v78,75.5
  Bottom 0.203: v66.5,67.5 70.9,67.5 78,74.59 v78,75.5
N$1
  Top 0.203: VR1.2 25.93,22.01 26.78,21.16 VR1.1 28.57,21.16 28.95,21.54 R9.2
N$2
  Top 0.254: Q4.G R13.1
N$3
  Top 0.254: Q6.G R19.1
N$4
  Top 0.254: Q3.G 87.24,88.44 87.38,88.3 87.77,88.3 87.96,88.11 R16.1
N$5
  Top 0.305: R6.1 95.08,78.58 94.5,78 92.66,78 C21.1 92.6,78.86 92.44,79.02 92.13,79.02 92,79.15 U2.3
N$6
  Top 0.61: D1.A U3.1
  Top 0.813: D1.A 18.02,34.48 L1.P$2
N$7
  Top 0.203: U1.9 70.09,63.76 R11.1
N$8  (via drill 0.35)
  Top 0.203: R10.2 R7.1 85.31,61.19 v83.5,63 | U1.8 70.55,63.51 v70.93,63.51
  Bottom 0.203: v83.5,63 82.5,63 81.4,61.9 79.1,61.9 77.49,63.51 v70.93,63.51
N$9
  Top 0.203: U1.16 C8.1
N$10
  Top 0.254: R4.1 83.35,72 84,72 SP1.1
N$11
  Top 0.406: C13.1 U3.3
N$12
  Top 0.203: U3.5 R8.2 26.43,23.07 26.64,22.86 VR1.3
N$13
  Top 0.406: U3.8 26.44,31.67 26.75,31.98 R1.1
N$14  (via drill 0.35)
  Top 0.406: L1.P$1 9.5,29.82 v10.07,29.25 | v24.61,29.15 26.42,29.15 U3.7 27.98,29.13 28.26,29.41 R1.2
  Top 0.813: R2.2 L1.P$1
  Bottom 0.406: v10.07,29.25 20,29.25 24.51,29.25 v24.61,29.15
N$15
  Top 0.254: R18.1 84.75,87.68 85.66,88.59 Q5.G
RTS  (via drill 0.35)
  Top 0.203: Q2.G Q1.S 60.77,67.65 v60.72,67.65 | U1.19 65.09,60.88 64.93,60.88 64.81,61 64.79,61 64.34,61.46 v64.34,61.98
  Bottom 0.203: v64.34,61.98 64.34,64.03 v60.72,67.65
SCL  (via drill 0.35)
  Top 0.203: v74.69,89.14 74.69,89.49 U8.36 | U2.5 v93.55,78.97
  Bottom 0.203: v93.55,78.97 90.53,78.97 89,80.5 82.45,80.5 76.57,86.38 76.57,87.26 v74.69,89.14
SDA  (via drill 0.35)
  Top 0.203: v77.52,86.33 77.52,86.93 U8.33 | v92.55,83.07 92.7,82.92 U2.7
  Bottom 0.203: v92.55,83.07 90.12,83.07 89.72,82.66 89.72,81.81 89.07,81.16 82.69,81.16 v77.52,86.33
SP
  Top 0.254: U8.16 78.71,68.5 79.85,68.5 R4.2
STR  (via drill 0.35)
  Top 0.203: U4.16 16,57.31 v16,60.5
  Bottom 0.203: v16,60.5 6.5,70 6.5,85.5 11,90 29,90 31,92 J5.6
SW
  Top 0.203: R12.1 SW1.1
VBUS
  Top 0.203: R7.2 83.57,59.71 83.57,60.71 82.78,61.5 79,61.5 78.3,60.8 J1.VCC
VFD2
  Top 0.254: U4.23 24.9,60.4 28.5,64 33.5,64 34.5,65 34.5,76.67 32.64,78.52 DIS1.2
VFD3
  Top 0.254: DIS1.3 31.82,80.17 35,77 35,64.67 33.83,63.5 29.5,63.5 26.17,60.17 U4.24
VFD4
  Top 0.254: U4.25 27.44,59.94 30.5,63 34.17,63 35.5,64.33 35.5,77.33 31.13,81.7 DIS1.4
VFD5
  Top 0.254: DIS1.5 30.63,83.1 36,77.73 36,63.98 34.52,62.5 31,62.5 28.71,60.21 U4.26
VFD9
  Top 0.254: DIS1.9 14.71,82.71 11.5,79.5 11.5,64.5 13.5,62.5 17,62.5 17.25,62.25 17.28,62.21 19.82,59.67 U4.19
VFD10
  Top 0.254: DIS1.10 15.32,81.32 12,78 12,64.77 13.77,63 18,63 21.09,59.9 U4.20
VFD11
  Top 0.254: DIS1.11 15.04,79.54 12.5,77 12.5,65 14,63.5 19,63.5 19.75,62.75 19.82,62.67 22.36,60.13 U4.21
VFD12
  Top 0.254: DIS1.12 14.76,77.76 13,76 13,65.21 14.21,64 20,64 21,63 21.09,62.9 23.63,60.36 U4.22
VFD14
  Top 0.254: DIS1.14 16.18,73.35 16.18,70.82 18.55,68.44 U4.11
VFD15
  Top 0.254: DIS1.15 17.53,70.39 19.82,68.1 U4.10
VFD16
  Top 0.254: DIS1.16 19.19,70.29 21.09,68.38 U4.9
VFD17
  Top 0.254: DIS1.17 22.36,68.87 U4.8
VFD18
  Top 0.254: U4.7 23.63,69.63 DIS1.18
VFD19
  Top 0.254: U4.6 24.9,69.63 DIS1.19
VFD20
  Top 0.254: U4.5 26.17,68.67 27.19,69.69 DIS1.20
VFD21
  Top 0.254: U4.4 27.44,68.44 28.58,69.59 DIS1.21
VFD22
  Top 0.254: U4.3 28.71,68.61 29.99,69.89 29.99,73.82 DIS1.22
VFD_BL
  Top 0.203: R14.1 75.65,97.69 76,97.34 76,94.08 76.26,93.82 J3.2
  Top 0.254: Q4.D 77.53,90.76 77,91.29 J3.2
VFD_CLK  (via drill 0.35)
  Top 0.203: v84,96 83.17,96 J3.5
  Top 0.254: Q6.D 96.93,86.57 v95,88.5 94.26,89.24 R20.1
  Bottom 0.203: v95,88.5 92.5,91 87.5,91 84,94.5 v84,96
VFD_DATA
  Top 0.254: Q5.D 83.66,91.8 81.63,93.82 J3.4 81,96.5 80.35,97.15 R17.1
VFD_STR
  Top 0.254: R15.1 89.2,91.28 89.01,91.09 Q3.D 87.5,91.09 87.29,91.3 87.29,92.21 85.67,93.82 J3.6

### Text on the board
tPlace: Nostalgy | Designed by Kinoshita(@_nosita) | vfd tube drive board rev.2 | nittc meister2018